# Altium schematic sheet GPIO.SchDoc
size A4; SheetNumber: 5
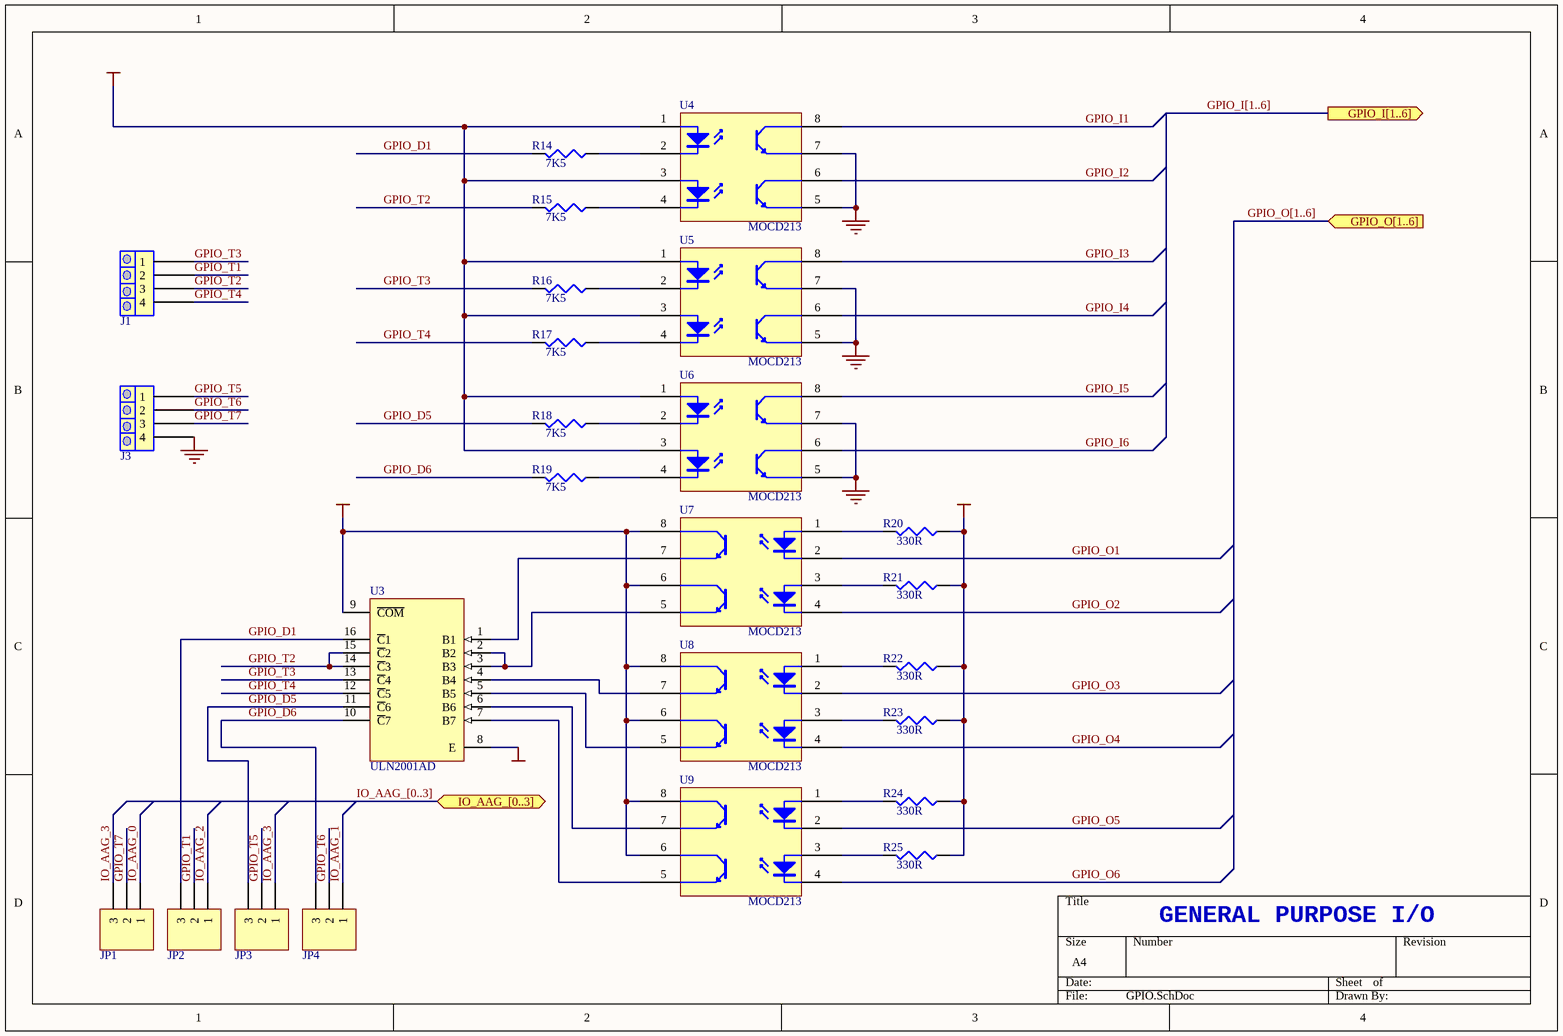
[diagram p0: GPIO.SchDoc]

## Parts
J1  BORNERA_X4  [BORNERA_X4]  (value not drawn)
J3  BORNERA_X4  [BORNERA_X4]  (value not drawn)
JP1  Header 3  [HDR1X3]  (value not drawn)
JP2  Header 3  [HDR1X3]  (value not drawn)
JP3  Header 3  [HDR1X3]  (value not drawn)
JP4  Header 3  [HDR1X3]  (value not drawn)
R14  value 7K5  [_0805]  (hidden comment: Res3)
R15  value 7K5  [_0805]  (hidden comment: Res3)
R16  value 7K5  [_0805]  (hidden comment: Res3)
R17  value 7K5  [_0805]  (hidden comment: Res3)
R18  value 7K5  [_0805]  (hidden comment: Res3)
R19  value 7K5  [_0805]  (hidden comment: Res3)
R20  value 330R  [_0805]  (hidden comment: Res3)
R21  value 330R  [_0805]  (hidden comment: Res3)
R22  value 330R  [_0805]  (hidden comment: Res3)
R23  value 330R  [_0805]  (hidden comment: Res3)
R24  value 330R  [_0805]  (hidden comment: Res3)
R25  value 330R  [_0805]  (hidden comment: Res3)
U3  ULN2001AD  [D016]
U4  MOCD213  [SO-G8/D5]
U5  MOCD213  [SO-G8/D5]
U6  MOCD213  [SO-G8/D5]
U7  MOCD213  [SO-G8/D5]
U8  MOCD213  [SO-G8/D5]
U9  MOCD213  [SO-G8/D5]

## Ports
GPIO_I[1..6] (out), GPIO_O[1..6] (in), IO_AAG_[0..3] (bidir)

## Nets
GND: J3.4 U4.5 U4.7 U5.5 U5.7 U6.5 U6.7
GND_PWR: U3.8(E)
VCC_3V: R20.1 R21.1 R22.1 R23.1 R24.1 R25.1
VCC_PWR: U3.9(~{COM}) U4.1 U4.3 U5.1 U5.3 U6.1 U6.3 U7.6 U7.8 U8.6 U8.8 U9.6 U9.8
GPIO_D1: JP2.3 R14.2 U3.16(~{C}1)
GPIO_D5: JP3.3 R18.2 U3.11(~{C}6)
GPIO_D6: JP4.3 R19.2 U3.10(~{C}7)
GPIO_I1: U4.8
GPIO_I2: U4.6
GPIO_I3: U5.8
GPIO_I4: U5.6
GPIO_I5: U6.8
GPIO_I6: U6.6
GPIO_O1: U7.2
GPIO_O2: U7.4
GPIO_O3: U8.2
GPIO_O4: U8.4
GPIO_O5: U9.2
GPIO_O6: U9.4
GPIO_T1: J1.2 JP2.2
GPIO_T2: J1.3 R15.2 U3.14(~{C}3) U3.15(~{C}2)
GPIO_T3: J1.1 R16.2 U3.13(~{C}4)
GPIO_T4: J1.4 R17.2 U3.12(~{C}5)
GPIO_T5: J3.1 JP3.2
GPIO_T6: J3.2 JP4.2
GPIO_T7: J3.3 JP1.2
IO_AAG_0: JP1.1
IO_AAG_1: JP4.1
IO_AAG_2: JP2.1
IO_AAG_3: JP1.3 JP3.1
NetR14_1: R14.1 U4.2
NetR15_1: R15.1 U4.4
NetR16_1: R16.1 U5.2
NetR17_1: R17.1 U5.4
NetR18_1: R18.1 U6.2
NetR19_1: R19.1 U6.4
NetR20_2: R20.2 U7.1
NetR21_2: R21.2 U7.3
NetR22_2: R22.2 U8.1
NetR23_2: R23.2 U8.3
NetR24_2: R24.2 U9.1
NetR25_2: R25.2 U9.3
NetU3_1: U3.1(B1) U7.7
NetU3_2: U3.2(B2) U3.3(B3) U7.5
NetU3_4: U3.4(B4) U8.7
NetU3_5: U3.5(B5) U8.5
NetU3_6: U3.6(B6) U9.7
NetU3_7: U3.7(B7) U9.5

## Buses and harness runs
bus GPIO_I[1..6] = port GPIO_I[1..6]
bus GPIO_O[1..6] = port GPIO_O[1..6]
bus IO_AAG_[0..3] = port IO_AAG_[0..3]

## Notes on the sheet
- GENERAL PURPOSE I/O

## Library data of the parts
JP1-JP4 = Header 3: Header, 3-Pin; Revision: 17-Jul-2002: Re-released for DXP Platform.; Publisher: Altium Limited
R14-R25 = Res3: Resistor; Published: 8-Jun-2000; Revision: July-2002: Re-released for DXP Platform.; Publisher: Altium Limited
U3 = ULN2003AD: Darlington Transistor Array; Package Information: Latest Revision: Jan-1998; Published: 15-May-2002; Datasheet: 1991 Interface Circuits Data Book (Sep-1986); Package Reference: D016; Publisher: Altium Limited
U4-U9 = MOCD213: Dual Channel Phototransistor